# EAGLE schematic OneSchematicToRuleThemAll (EAGLE 9.5.1)
COMPANY: Inspire Clean Enery Pvt Ltd; DATE: 15/07/2020; DESIGNEDBY: Athar Zafeer
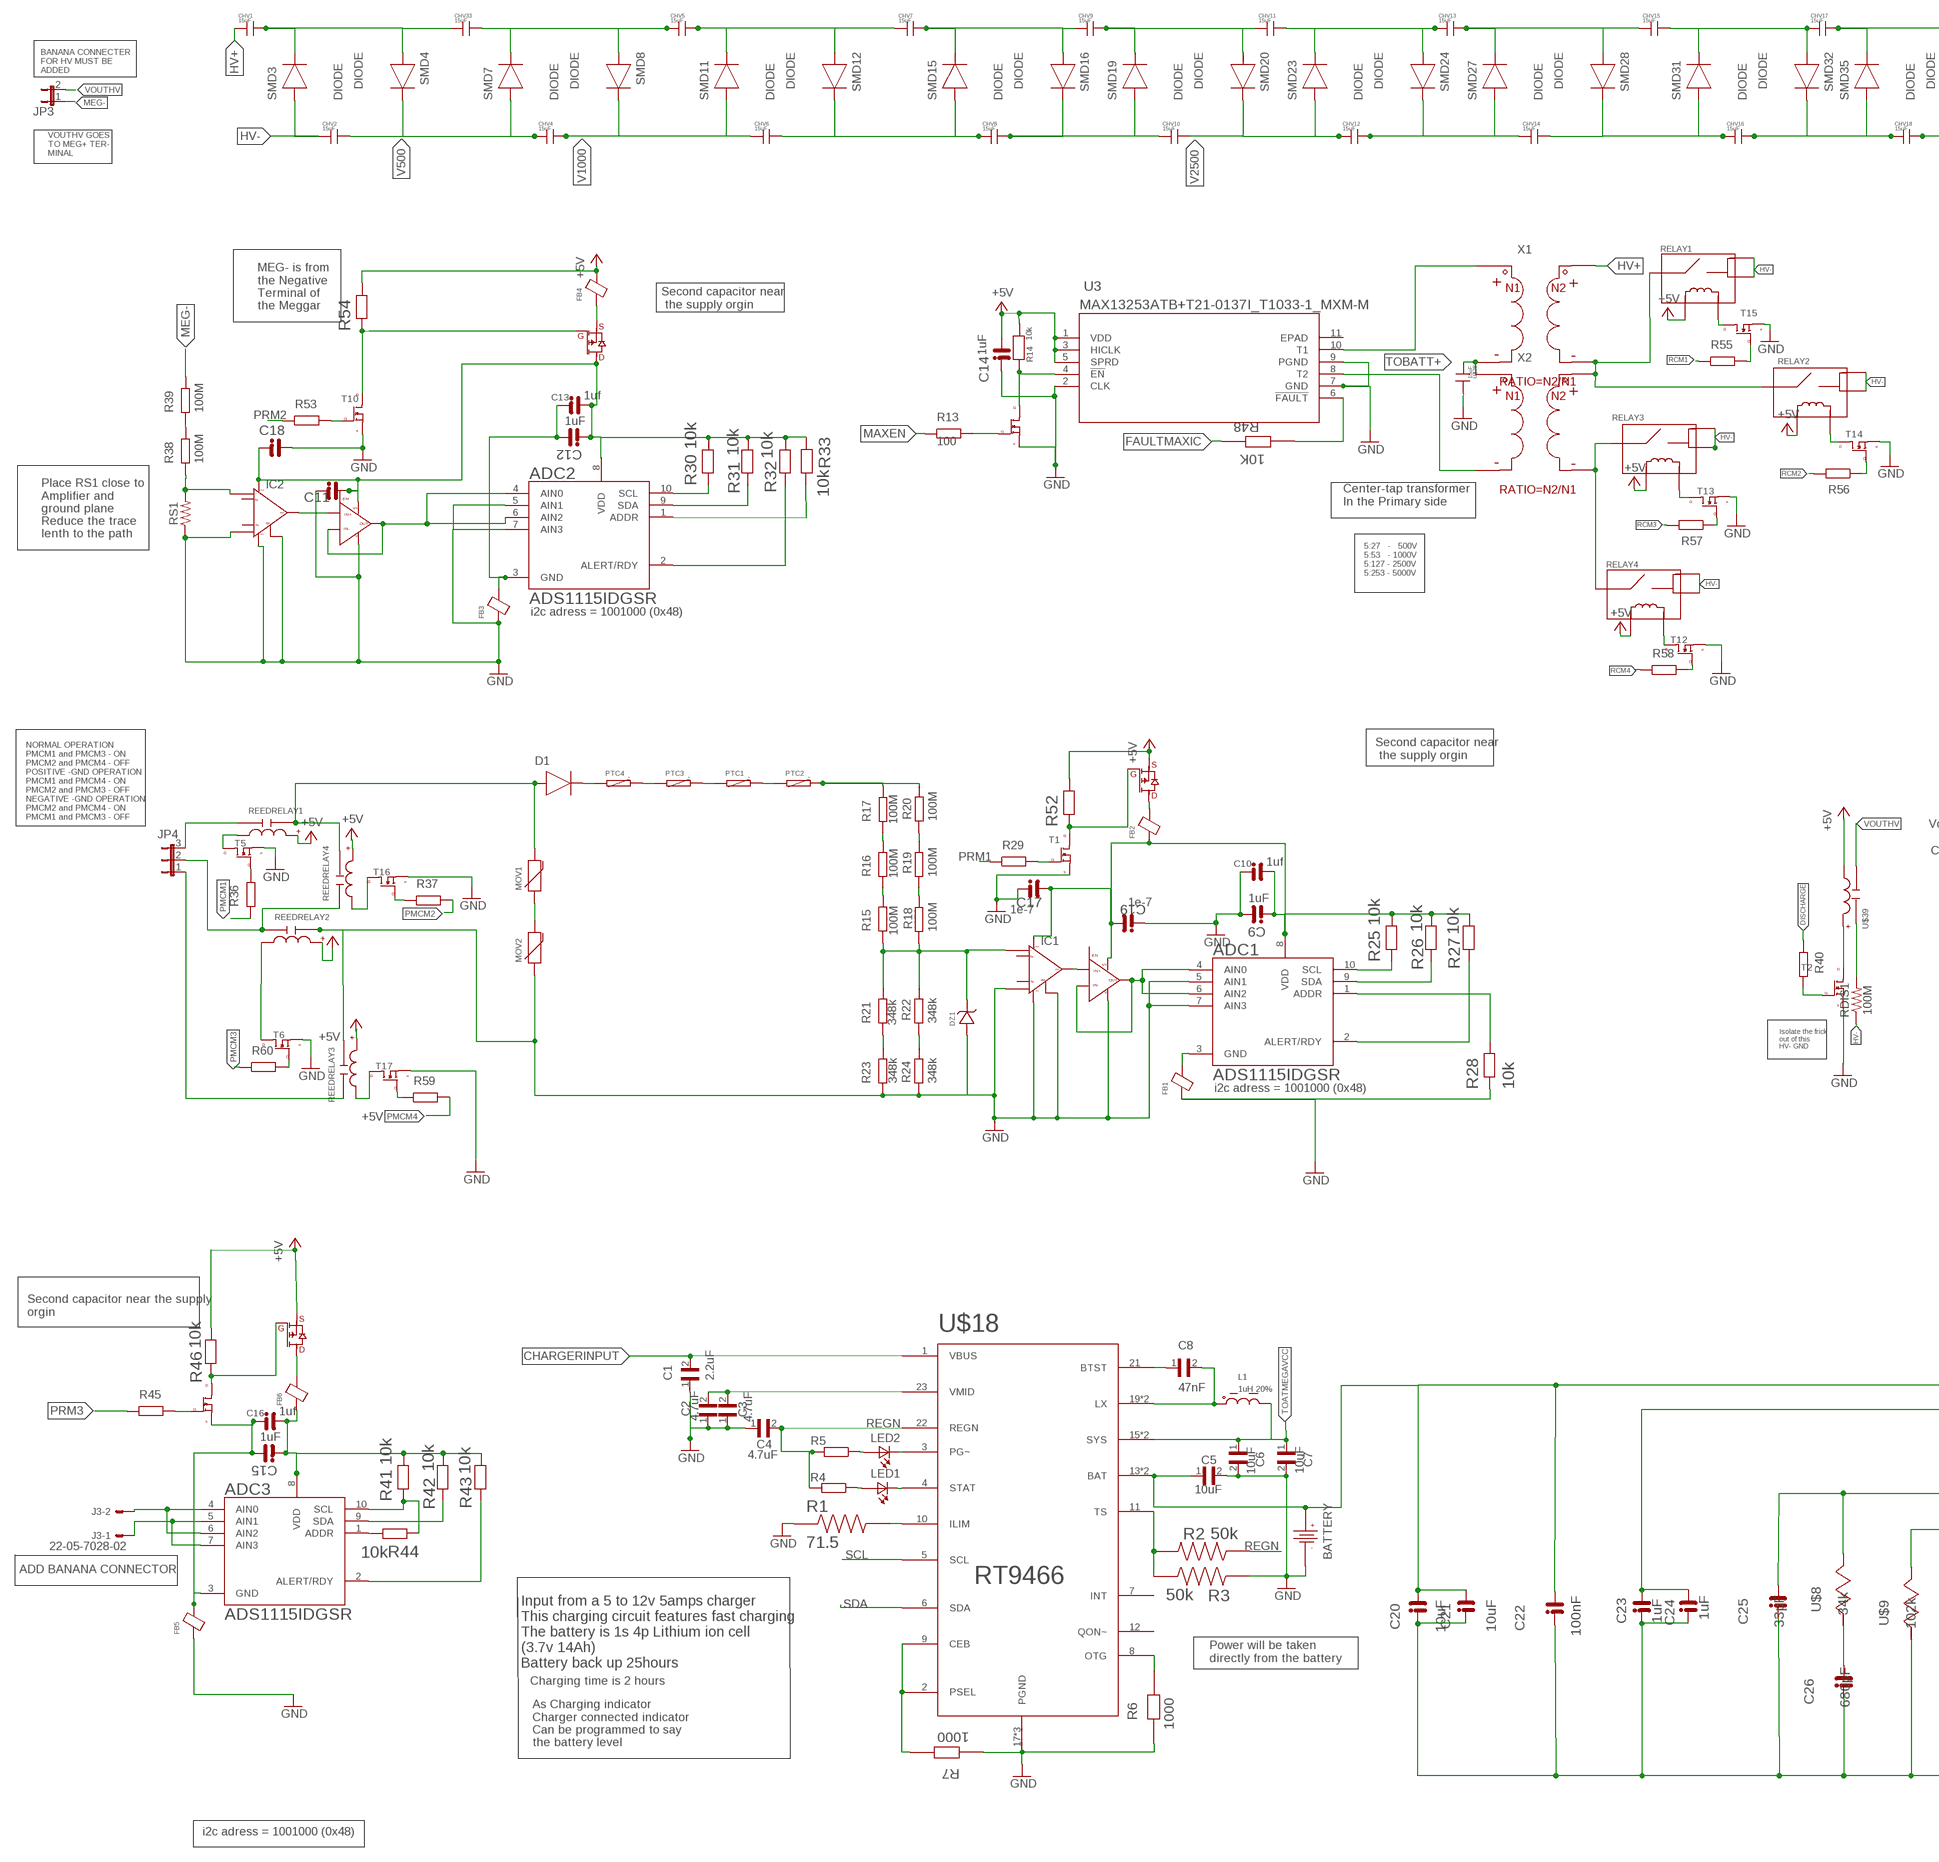
[diagram p0: schematic, sheet 1, part 1 of 2]
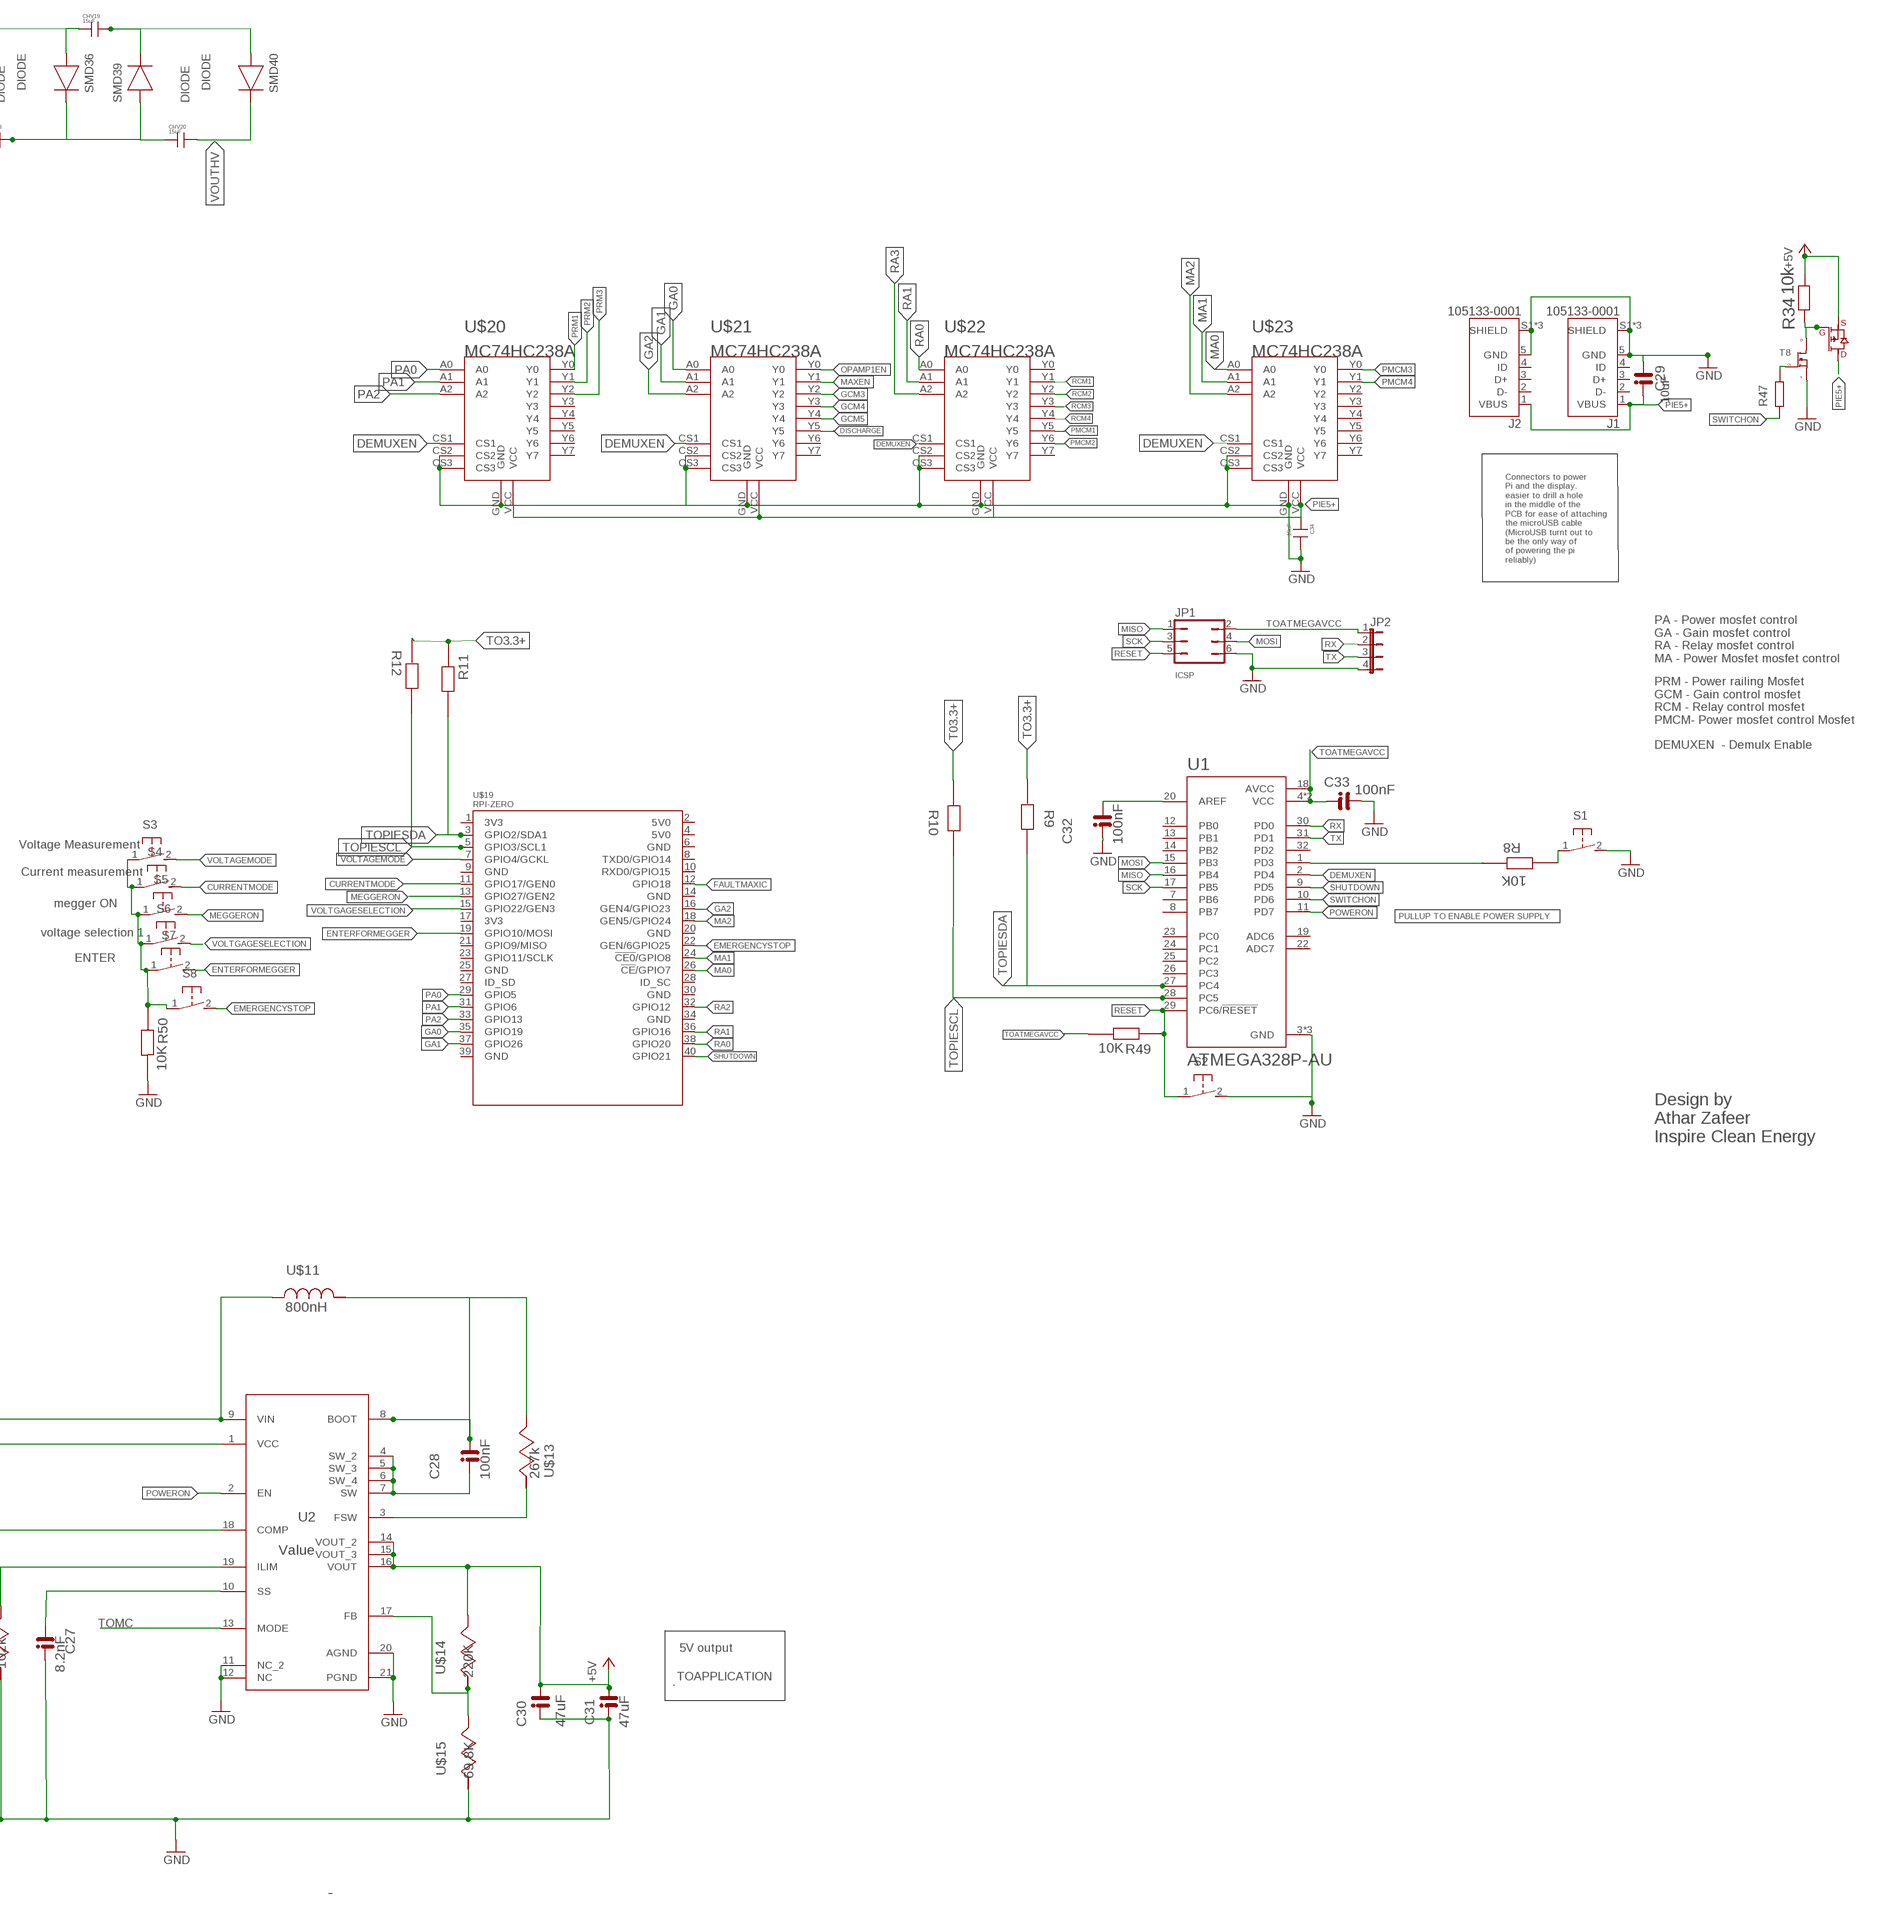
[diagram p1: schematic, sheet 1, part 2 of 2]

## Parts
ADC1  ADS1115IDGSR  [SOP50P490X110-10N]
ADC2  ADS1115IDGSR  [SOP50P490X110-10N]
ADC3  ADS1115IDGSR  [SOP50P490X110-10N]
BATT1  BATPADS  [PADSBATT]
C1  2.2uF  GRM155R61E225KE11D  [CAPC1005X70N]
C2  4.7uF  GRM188R61E475KE11D  [CAPC1608X95N]
C3  4.7uF  GRM188R61E475KE11D  [CAPC1608X95N]
C4  4.7uF  GRM188R61E475KE11D  [CAPC1608X95N]
C5  10uF  GRM185R60J106ME15J  [CAPC1608X50N]
C6  10uF  GRM185R60J106ME15J  [CAPC1608X50N]
C7  10uF  GRM185R60J106ME15J  [CAPC1608X50N]
C8  47nF  GRM033R61C473KE84D  [CAPC0603X33N]
C9  1uF  EMK107B7105KA-T  [0603]
C10  1uf  EMK107B7105KA-T  [0603]
C11  CC0402KRX5R7BB104  [0402]
C12  1uF  EMK107B7105KA-T  [0603]
C13  1uf  EMK107B7105KA-T  [0603]
C14  1uF  EMK107B7105KA-T  [0603]
C15  1uF  EMK107B7105KA-T  [0603]
C16  1uf  EMK107B7105KA-T  [0603]
C17  1e-7  CC0402KRX5R7BB104  [0402]
C18  CC0402KRX5R7BB104  [0402]
C19  1e-7  CC0402KRX5R7BB104  [0402]
C20  10uF  CC1206ZKY5V7BB106  [1206_190]
C21  10uF  CC1206ZKY5V7BB106  [1206_190]
C22  100nF  CC0402KRX5R7BB104  [0402]
C23  1uF  EMK107B7105KA-T  [0603]
C24  1uF  EMK107B7105KA-T  [0603]
C25  33pF  885012005043  [0402]
C26  680pF  CL10C681JA8NNNC  [0603]
C27  8.2nF  CC0402KRX7R7BB822  [0402]
C28  100nF  CC0402KRX5R7BB104  [0402]
C29  10uF  CC1206ZKY5V7BB106  [1206_190]
C30  47uF  C5750X5R1C476M230KA  [2220_250]
C31  47uF  C5750X5R1C476M230KA  [2220_250]
C32  100nF  CC0402KRX5R7BB104  [0402]
C33  100nF  CC0402KRX5R7BB104  [0402]
C34  15uF  CAPACTORFORTRANSFORMER  [C1210C156K8PACTU]
CHV1  15uF  CAPACITORSMDC5750SMD  [C5750]
CHV2  15uF  CAPACITORSMDC5750SMD  [C5750]
CHV4  15uF  CAPACITORSMDC5750SMD  [C5750]
CHV5  15uF  CAPACITORSMDC5750SMD  [C5750]
CHV6  15uF  CAPACITORSMDC5750SMD  [C5750]
CHV7  15uF  CAPACITORSMDC5750SMD  [C5750]
CHV8  15uF  CAPACITORSMDC5750SMD  [C5750]
CHV9  15uF  CAPACITORSMDC5750SMD  [C5750]
CHV10  15uF  CAPACITORSMDC5750SMD  [C5750]
CHV11  15uF  CAPACITORSMDC5750SMD  [C5750]
CHV12  15uF  CAPACITORSMDC5750SMD  [C5750]
CHV13  15uF  CAPACITORSMDC5750SMD  [C5750]
CHV14  15uF  CAPACITORSMDC5750SMD  [C5750]
CHV15  15uF  CAPACITORSMDC5750SMD  [C5750]
CHV16  15uF  CAPACITORSMDC5750SMD  [C5750]
CHV17  15uF  CAPACITORSMDC5750SMD  [C5750]
CHV18  15uF  CAPACITORSMDC5750SMD  [C5750]
CHV19  15uF  CAPACITORSMDC5750SMD  [C5750]
CHV20  15uF  CAPACITORSMDC5750SMD  [C5750]
CHV33  15uF  CAPACITORSMDC5750SMD  [C5750]
D1  GI1-1600GP-E3/54  [DO-15(DO-204AC)]
DZ1  PLZ4V3A-G3/H  [DO-219AC]
FB1  MMZ2012Y152BT000  [0805(2012METRIC)]
FB2  MMZ2012Y152BT000  [0805(2012METRIC)]
FB3  MMZ2012Y152BT000  [0805(2012METRIC)]
FB4  MMZ2012Y152BT000  [0805(2012METRIC)]
FB5  MMZ2012Y152BT000  [0805(2012METRIC)]
FB6  MMZ2012Y152BT000  [0805(2012METRIC)]
IC1  INA333  [8-VSSOP]
IC2  INA333  [8-VSSOP]
J1  105133-0001  [MOLEX_105133-0001]
J2  105133-0001  [MOLEX_105133-0001]
J3  22-05-7028-02  [7395-02]
JP1  JP3Q  [JP3Q]
JP2  JP4E  [JP4]
JP3  JP1E  [JP1]
JP4  JP2E  [JP2]
L1  1uH 20%  74438356010  [4020]
LED1  LTST-C191KGKT  [0603]
LED2  LTST-C191KGKT  [0603]
MOV1  V1000LA160BP  [CAPRR750W81L2100T1100H2300P]
MOV2  V1000LA160BP  [CAPRR750W81L2100T1100H2300P]
PTC1  PTCCL05H100SBE  [RADIAL,DISC]
PTC2  PTCCL05H100SBE  [RADIAL,DISC]
PTC3  PTCCL05H100SBE  [RADIAL,DISC]
PTC4  PTCCL05H100SBE  [RADIAL,DISC]
R1  71.5  RC0402FR-0771R5L  [RESC1005X40N]
R2  50k  ERA-3AEB4992V  [RESC1608X55N]
R3  50k  ERA-3AEB4992V  [RESC1608X55N]
R4  RX0402_100  [RC0402_100]
R5  RX0402_100  [RC0402_100]
R6  1000  ERJ-2GEJ102X  [RESC1005X40N]
R7  1000  ERJ-2GEJ102X  [RESC1005X40N]
R8  10K  ERJ-2GEJ102X  [RESC1005X40N]
R9  ERJ-2GEJ102X  [RESC1005X40N]
R10  ERJ-2GEJ102X  [RESC1005X40N]
R11  ERJ-2GEJ102X  [RESC1005X40N]
R12  ERJ-2GEJ102X  [RESC1005X40N]
R13  100  RX0402_100  [RC0402_100]
R14  10k  ERJ-3GEYJ103V  [RESC1608X55N]
R15  100M  HVA12FA100M  [AXIAL]
R16  100M  HVA12FA100M  [AXIAL]
R17  100M  HVA12FA100M  [AXIAL]
R18  100M  HVA12FA100M  [AXIAL]
R19  100M  HVA12FA100M  [AXIAL]
R20  100M  HVA12FA100M  [AXIAL]
R21  348k  HVR2500003483FR500  [AXIAL]
R22  348k  HVR2500003483FR500  [AXIAL]
R23  348k  HVR2500003483FR500  [AXIAL]
R24  348k  HVR2500003483FR500  [AXIAL]
R25  10k  ERJ-3GEYJ103V  [RESC1608X55N]
R26  10k  ERJ-3GEYJ103V  [RESC1608X55N]
R27  10k  ERJ-3GEYJ103V  [RESC1608X55N]
R28  10k  ERJ-3GEYJ103V  [RESC1608X55N]
R29  RX0402_100  [RC0402_100]
R30  10k  ERJ-3GEYJ103V  [RESC1608X55N]
R31  10k  ERJ-3GEYJ103V  [RESC1608X55N]
R32  10k  ERJ-3GEYJ103V  [RESC1608X55N]
R33  10k  ERJ-3GEYJ103V  [RESC1608X55N]
R34  10k  ERJ-3GEYJ103V  [RESC1608X55N]
R36  RX0402_100  [RC0402_100]
R37  RX0402_100  [RC0402_100]
R38  100M  HVA12FA100M  [AXIAL]
R39  100M  HVA12FA100M  [AXIAL]
R40  RX0402_100  [RC0402_100]
R41  10k  ERJ-3GEYJ103V  [RESC1608X55N]
R42  10k  ERJ-3GEYJ103V  [RESC1608X55N]
R43  10k  ERJ-3GEYJ103V  [RESC1608X55N]
R44  10k  ERJ-3GEYJ103V  [RESC1608X55N]
R45  RX0402_100  [RC0402_100]
R46  10k  ERJ-3GEYJ103V  [RESC1608X55N]
R47  RX0402_100  [RC0402_100]
R48  10K  ERJ-2GEJ102X  [RESC1005X40N]
R49  10K  ERJ-2GEJ102X  [RESC1005X40N]
R50  10K  ERJ-2GEJ102X  [RESC1005X40N]
R52  ERJ-3GEYJ103V  [RESC1608X55N]
R53  RX0402_100  [RC0402_100]
R54  ERJ-3GEYJ103V  [RESC1608X55N]
R55  RX0402_100  [RC0402_100]
R56  RX0402_100  [RC0402_100]
R57  RX0402_100  [RC0402_100]
R58  RX0402_100  [RC0402_100]
R59  RX0402_100  [RC0402_100]
R60  RX0402_100  [RC0402_100]
RDIS1  100M  RESISTOR20OHM  [RADIAL]
REEDRELAY1  REEDRELAYSPDT  [3351-1275-126]
REEDRELAY2  REEDRELAYSPDT  [3351-1275-126]
REEDRELAY3  REEDRELAYSPDT  [3351-1275-126]
REEDRELAY4  REEDRELAYSPDT  [3351-1275-126]
RELAY1  T9GS1L14-5  [T9GTERMINATIONCODE1]
RELAY2  T9GS1L14-5  [T9GTERMINATIONCODE1]
RELAY3  T9GS1L14-5  [T9GTERMINATIONCODE1]
RELAY4  T9GS1L14-5  [T9GTERMINATIONCODE1]
RS1  CURRENTSENSERESISTOR  [SL2TTED1002F]
S1  31-XX  [B3F-31XX]
S2  31-XX  [B3F-31XX]
S3  Voltage Measurement  31-XX  [B3F-31XX]
S4  Current measurement  31-XX  [B3F-31XX]
S5  megger ON  31-XX  [B3F-31XX]
S6  voltage selection 1  31-XX  [B3F-31XX]
S7  ENTER  31-XX  [B3F-31XX]
S8  EMERGENCY STOP  31-XX  [B3F-31XX]
SMD3  DIODE  [SMA]
SMD4  DIODE  [SMA]
SMD7  DIODE  [SMA]
SMD8  DIODE  [SMA]
SMD11  DIODE  [SMA]
SMD12  DIODE  [SMA]
SMD15  DIODE  [SMA]
SMD16  DIODE  [SMA]
SMD19  DIODE  [SMA]
SMD20  DIODE  [SMA]
SMD23  DIODE  [SMA]
SMD24  DIODE  [SMA]
SMD27  DIODE  [SMA]
SMD28  DIODE  [SMA]
SMD31  DIODE  [SMA]
SMD32  DIODE  [SMA]
SMD35  DIODE  [SMA]
SMD36  DIODE  [SMA]
SMD39  DIODE  [SMA]
SMD40  DIODE  [SMA]
T1  SI2302A  [SOT-23]
T2  SI2302A  [SOT-23]
T3  NX2301P,215  [SOT-23]
T5  SI2302A  [SOT-23]
T6  SI2302A  [SOT-23]
T7  NX2301P,215  [SOT-23]
T8  SI2302A  [SOT-23]
T9  NX2301P,215  [SOT-23]
T10  SI2302A  [SOT-23]
T11  NX2301P,215  [SOT-23]
T12  SI2302A  [SOT-23]
T13  SI2302A  [SOT-23]
T14  SI2302A  [SOT-23]
T15  SI2302A  [SOT-23]
T16  SI2302A  [SOT-23]
T17  SI2302A  [SOT-23]
U1  ATMEGA328P-AU  [QFP80P900X900X120-32N]
U2  Value  TPS61088RHLR  [RHL0020A]
U3  MAX13253ATB+T21-0137I_T1033-1_MXM-M  [21-0137I_T1033-1_MXM-M]
U$8  34k  CRCW040234K0FKED  [0402]
U$9  102k  CRCW0402102KFKED  [0402]
U$11  800nH  XAL5020-801MEB  [XAL5020]
U$13  267k  CRCW0402267KFKED  [0402]
U$14  220K  RC0603FR-07220KL  [0603]
U$15  69.8K  CRCW040269K8FKED  [0402]
U$18  RT9466  [V/W/U/XQFN4*4-24]
U$19  RPI-ZERO  [RASPBERRYPI_BASTELSTUBE_V13_RASPI_BOARD_B+_FULL]
U$20  MC74HC238A  [TSSOP−16]
U$21  MC74HC238A  [TSSOP−16]
U$22  MC74HC238A  [TSSOP−16]
U$23  MC74HC238A  [TSSOP−16]
U$25  OPA300-ND  [SOT23-6]
U$28  15uF  CAPACTORFORTRANSFORMER  [C1210C156K8PACTU]
U$29  OPA300-ND  [SOT23-6]
U$33  SI2302A  [SOT-23]
U$39  REEDRELAYSPDT  [3351-1275-126]
U$44  SI2302A  [SOT-23]
X1  TRANSFORMER  (no package)
X2  TRANSFORMER  (no package)

## Nets
+5V: C14.1 C30.1 C31.1 FB4.P$2 R14.2 R34.2 R46.2 R52.2 R54.2 REEDRELAY1.2 REEDRELAY2.2 REEDRELAY3.2 REEDRELAY4.2 RELAY1.C1 RELAY2.C1 RELAY3.C1 RELAY4.C1 T3.S T7.S T9.S U2.14(VOUT_2) U2.15(VOUT_3) U2.16(VOUT) U3.1(VDD) U3.3(HICLK) U3.5(SPRD) U$14.1 U$39.3
BATT+: BATT1.1 C5.1 C20.1 C21.1 C22.1 U2.9(VIN) U$11.1 U$18.13(BAT) U$18.14(BAT)
CHARGERINPUT: C1.2 U$18.1(VBUS)
CURRENTMODE: S4.2(S) U$19.11(GPIO17/GEN0)
DEMUXEN: U1.2(PD4) U$20.CS1 U$21.CS1 U$22.CS1 U$23.CS1
DISCHARGE: R40.P$1 U$21.Y5
EMERGENCYSTOP: S8.2(S) U$19.22(GEN/6GPIO25)
ENTERFORMEGGER: S7.2(S) U$19.19(GPIO10/MOSI)
FAULTMAXIC: R48.2 U$19.12(GPIO18)
GA0: U$19.35(GPIO19) U$21.A0
GA1: U$19.37(GPIO26) U$21.A1
GA2: U$19.16(GEN4/GPIO23) U$21.A2
GCM3: U$21.Y2
GCM4: U$21.Y3
GCM5: U$21.Y4
GND: ADC1.5(AIN1) ADC1.7(AIN3) ADC2.5(AIN1) ADC2.7(AIN3) BATT1.2 C1.1 C2.1 C3.1 C4.1 C5.2 C6.2 C7.2 C9.1 C10.2 C11.2 C14.2 C17.2 C18.1 C19.2 C20.2 C21.2 C22.2 C23.2 C24.2 C25.2 C26.2 C27.2 C29.1 C30.2 C31.2 C32.2 C33.1 C34.P$2 DZ1.P$1 FB1.P$1 FB3.P$1 FB5.P$1 IC1.-IN IC1.REF IC1.V-(-VS) IC2.-IN IC2.REF IC2.V-(-VS) J1.5(GND) J1.S1(SHIELD) J1.S2(SHIELD) J1.S3(SHIELD) J2.5(GND) J2.S1(SHIELD) J2.S2(SHIELD) J2.S3(SHIELD) JP1.6 JP2.4 MOV2.1 R1.1 R3.2 R6.1 R7.1 R23.P$1 R24.P$1 R28.1 R50.1 REEDRELAY2.1 REEDRELAY3.1 RS1.P$1 S1.2(S) S2.2(S) T1.S T2.S T5.S T6.S T8.S T10.S T12.S T13.S T14.S T15.S T16.S T17.S U1.3(GND) U1.5(GND) U1.21(GND) U2.11(NC_2) U2.12(NC) U2.20(AGND) U2.21(PGND) U3.2(CLK) U3.7(GND) U3.9(PGND) U$9.2 U$15.2 U$18.17(PGND) U$18.18(PGND) U$18.25(PGND) U$20.CS2 U$20.CS3 U$20.GND U$21.CS2 U$21.CS3 U$21.GND U$22.CS2 U$22.CS3 U$22.GND U$23.CS2 U$23.CS3 U$23.GND U$25.P$2(V-) U$28.P$2 U$29.P$2(V-) U$33.S
HV+: CHV1.P$1 X1.P$3
HV-: CHV2.P$1 RDIS1.P$1 RELAY1.NO RELAY1.P$1 RELAY2.NO RELAY2.P$1 RELAY3.COM RELAY3.NO RELAY3.P$1 RELAY4.COM RELAY4.NO RELAY4.P$1 SMD3.P$1(A) X2.P$4
MA0: U$19.26(!CE!/GPIO7) U$23.A0
MA1: U$19.24(!CE0!/GPIO8) U$23.A1
MA2: U$19.18(GEN5/GPIO24) U$23.A2
MAXEN: R13.P$1 U$21.Y1
MEG-: JP3.1 R39.P$2
MEGGERON: S5.2(S) U$19.13(GPIO27/GEN2)
MISO: JP1.1 U1.16(PB4)
MOSI: JP1.4 U1.15(PB3)
N$2: C32.1 U1.20(AREF)
N$5: C23.1 C24.1 U2.1(VCC)
N$6: C26.1 U$8.2
N$7: R8.1 S1.1(P)
N$8: C2.2 C3.2 U$18.23(VMID)
N$9: C25.1 U2.18(COMP) U$8.1
N$10: U2.19(ILIM) U$9.1
N$11: C27.1 U2.10(SS)
N$12: LED1.2(A2) R4.P$1
N$13: C8.1 U$18.21(BTST)
N$14: U2.3(FSW) U$13.2
N$15: C28.2 U2.4(SW_2) U2.5(SW_3) U2.6(SW_4) U2.7(SW)
N$16: R53.P$2
N$17: C8.2 L1.P$1 U$18.19(LX) U$18.20(LX)
N$18: U2.17(FB) U$14.2 U$15.1
N$19: LED1.1(K2) U$18.4(STAT)
N$20: LED2.1(K2) U$18.3(PG~)
N$21: R1.2 U$18.10(ILIM)
N$22: R2.2 R3.1 U$18.11(TS)
N$23: LED2.2(A2) R5.P$1
N$24: R6.2 U$18.8(OTG)
N$25: R7.2 U$18.2(PSEL) U$18.9(CEB)
N$26: R34.1 T3.G T8.D
N$27: R48.1 U3.6(!FAULT)
N$28: R8.2 U1.1(PD3)
N$29: R47.P$2 T8.G
N$30: CHV1.P$2 CHV33.P$1 SMD3.P$2(C) SMD4.P$1(A)
N$31: CHV5.P$1 CHV33.P$2 SMD7.P$2(C) SMD8.P$1(A)
N$32: CHV5.P$2 CHV7.P$1 SMD11.P$2(C) SMD12.P$1(A)
N$33: CHV6.P$2 CHV8.P$1 SMD12.P$2(C) SMD15.P$1(A)
N$34: CHV7.P$2 CHV9.P$1 SMD15.P$2(C) SMD16.P$1(A)
N$35: CHV8.P$2 CHV10.P$1 SMD16.P$2(C) SMD19.P$1(A)
N$36: CHV9.P$2 CHV11.P$1 SMD19.P$2(C) SMD20.P$1(A)
N$37: CHV11.P$2 CHV13.P$1 SMD23.P$2(C) SMD24.P$1(A)
N$38: CHV12.P$2 CHV14.P$1 SMD24.P$2(C) SMD27.P$1(A)
N$39: CHV13.P$2 CHV15.P$1 SMD27.P$2(C) SMD28.P$1(A)
N$40: CHV15.P$2 CHV17.P$1 SMD31.P$2(C) SMD32.P$1(A)
N$41: CHV14.P$2 CHV16.P$1 SMD28.P$2(C) SMD31.P$1(A)
N$42: CHV16.P$2 CHV18.P$1 SMD32.P$2(C) SMD35.P$1(A)
N$43: CHV17.P$2 CHV19.P$1 SMD35.P$2(C) SMD36.P$1(A)
N$44: CHV19.P$2 SMD39.P$2(C) SMD40.P$1(A)
N$45: CHV18.P$2 CHV20.P$1 SMD36.P$2(C) SMD39.P$1(A)
N$46: R14.1 U3.4(!EN) U$33.D
N$47: U3.8(T2) X2.P$2
N$48: U3.10(T1) X1.P$1
N$49: RELAY1.COM RELAY2.COM X1.P$4 X2.P$3
N$50: IC2.+IN R38.P$1 RS1.P$2
N$52: R13.P$2 U$33.G
N$53: T2.D U$39.2
N$54: R40.P$2 T2.G
N$55: JP4.3 REEDRELAY1.4
N$56: JP4.2 REEDRELAY2.4 REEDRELAY4.4
N$57: PTC2.P$2 R17.P$2 R20.P$2
N$58: R15.P$2 R16.P$1
N$59: DZ1.P$2 IC1.+IN R15.P$1 R18.P$1 R21.P$2 R22.P$2
N$60: R21.P$1 R23.P$2
N$61: R16.P$2 R17.P$1
N$62: R18.P$2 R19.P$1
N$63: R22.P$1 R24.P$2
N$64: FB4.P$1 T11.S
N$65: R19.P$2 R20.P$1
N$66: ADC1.10(SCL) R25.1
N$67: D1.P$2(C) PTC4.P$1
N$68: PTC3.P$1 PTC4.P$2
N$69: PTC1.P$1 PTC3.P$2
N$70: PTC1.P$2 PTC2.P$1
N$71: MOV1.1 MOV2.2
N$72: ADC1.9(SDA) R26.1
N$73: ADC1.1(ADDR) R28.2
N$74: ADC1.2(ALERT/RDY) R27.1
N$75: IC1.VOUT(OUT) U$25.P$3(IN+)
N$76: R52.1 T1.D T9.G
N$78: C28.1 U2.8(BOOT) U$11.2 U$13.1
N$79: R29.P$2
N$80: JP4.1 REEDRELAY3.4
N$81: ADC2.10(SCL) R30.1
N$82: ADC2.9(SDA) R31.1
N$83: ADC2.1(ADDR) R33.2
N$84: ADC2.2(ALERT/RDY) R32.1
N$85: ADC2.3(GND) C12.1 C13.2 FB3.P$2
N$86: ADC2.8(VDD) R30.2 R31.2 R32.2 R33.1
N$89: REEDRELAY1.3 T5.D
N$90: R38.P$2 R39.P$1
N$91: REEDRELAY4.3 T16.D
N$92: R37.P$1 T16.G
N$93: RDIS1.P$2 U$39.1
N$94: ADC3.1(ADDR) R44.2
N$95: ADC3.10(SCL) R41.1 R44.1
N$96: ADC3.9(SDA) R42.1
N$97: ADC3.4(AIN0) ADC3.6(AIN2) J3.2
N$98: ADC3.2(ALERT/RDY) R43.1
N$99: ADC3.3(GND) C15.1 C16.2 FB5.P$2 U$44.S
N$100: ADC3.8(VDD) C15.2 C16.1 FB6.P$1 R41.2 R42.2 R43.2
N$101: ADC3.5(AIN1) ADC3.7(AIN3) J3.1
N$102: R45.P$2 U$44.G
N$103: FB2.P$2 T9.D
N$104: IC2.VOUT(OUT) U$29.P$3(IN+)
N$111: R50.2 S3.1(P) S4.1(P) S5.1(P) S6.1(P) S7.1(P) S8.1(P)
N$114: FB6.P$2 T7.D
N$115: R54.1 T10.D T11.G
N$116: R46.1 T7.G U$44.D
N$117: ADC1.8(VDD) C9.2 C10.1 C17.1 C19.1 FB2.P$1 IC1.V+(+VS) R25.2 R26.2 R27.2 U$25.P$6(V+)
N$118: ADC1.4(AIN0) ADC1.6(AIN2) U$25.P$1(OUT) U$25.P$4(IN-)
N$119: ADC2.4(AIN0) ADC2.6(AIN2) U$29.P$1(OUT) U$29.P$4(IN-)
N$120: C11.1 C12.2 C13.1 C18.2 IC2.V+(+VS) T11.D U$29.P$6(V+)
N$121: ADC1.3(GND) FB1.P$2
N$122: R36.P$2 T5.G
N$125: RELAY2.C2 T14.D
N$126: RELAY3.C2 T13.D
N$127: RELAY4.C2 T12.D
N$128: RELAY1.C2 T15.D
N$129: R55.P$2 T15.G
N$130: R56.P$1 T14.G
N$131: R57.P$1 T13.G
N$132: R58.P$2 T12.G
N$133: R60.P$2 T6.G
N$134: REEDRELAY2.3 T6.D
N$136: REEDRELAY3.3 T17.D
N$137: R59.P$1 T17.G
OPAMP1EN: U$21.Y0
PA0: U$19.29(GPIO5) U$20.A0
PA1: U$19.31(GPIO6) U$20.A1
PA2: U$19.33(GPIO13) U$20.A2
PIE5+: C29.2 C34.P$1 J1.1(VBUS) J2.1(VBUS) T3.D U$20.VCC U$21.VCC U$22.VCC U$23.VCC
PMCM1: R36.P$1 U$22.Y5
PMCM2: R37.P$2 U$22.Y6
PMCM3: R60.P$1 U$23.Y0
PMCM4: R59.P$2 U$23.Y1
POWERON: U1.11(PD7) U2.2(EN)
PRM1: R29.P$1 U$20.Y0
PRM2: R53.P$1 U$20.Y1
PRM3: R45.P$1 U$20.Y2
RA0: U$19.38(GPIO20) U$22.A0
RA1: U$19.36(GPIO16) U$22.A1
RA2: U$19.32(GPIO12)
RA3: U$22.A2
RCM1: R55.P$1 U$22.Y1
RCM2: R56.P$2 U$22.Y2
RCM3: R57.P$2 U$22.Y3
RCM4: R58.P$1 U$22.Y4
REGN: C4.2 R2.1 R4.P$2 R5.P$2 U$18.22(REGN)
RESET: JP1.5 R49.2 S2.1(P) U1.29(PC6/!RESET)
RX: JP2.2 U1.30(PD0)
SCK: JP1.3 U1.17(PB5)
SCL: U$18.5(SCL)
SDA: U$18.6(SDA)
SHUTDOWN: U1.9(PD5) U$19.40(GPIO21)
SWITCHON: R47.P$1 U1.10(PD6)
T03.3+: R10.1
TO3.3+: R9.1 R11.2 R12.1
TO+BANANA: D1.P$1(A) MOV1.2 REEDRELAY1.1 REEDRELAY4.1
TOATMEGAVCC: C6.1 C7.1 C33.2 JP1.2 JP2.1 L1.P$2 R49.1 U1.4(VCC) U1.6(VCC) U1.18(AVCC) U$18.15(SYS) U$18.16(SYS)
TOBATT+: U$28.P$1 X1.P$2 X2.P$1
TOMC: U2.13(MODE)
TOPIESCL: R10.2 R12.2 U1.28(PC5) U$19.5(GPIO3/SCL1)
TOPIESDA: R9.2 R11.1 U1.27(PC4) U$19.3(GPIO2/SDA1)
TX: JP2.3 U1.31(PD1)
V500: CHV2.P$2 CHV4.P$1 SMD4.P$2(C) SMD7.P$1(A)
V1000: CHV4.P$2 CHV6.P$1 SMD8.P$2(C) SMD11.P$1(A)
V2500: CHV10.P$2 CHV12.P$1 SMD20.P$2(C) SMD23.P$1(A)
VOLTAGEMODE: S3.2(S) U$19.7(GPIO4/GCKL)
VOLTGAGESELECTION: S6.2(S) U$19.15(GPIO22/GEN3)
VOUTHV: CHV20.P$2 JP3.2 SMD40.P$2(C) U$39.4
Unconnected: IC1.+RG IC1.-RG(RG-) IC2.+RG IC2.-RG(RG-) J1.2(D-) J1.3(D+) J1.4(ID) J2.2(D-) J2.3(D+) J2.4(ID) T1.G T10.G U1.7(PB6) U1.8(PB7) U1.12(PB0) U1.13(PB1) U1.14(PB2) U1.19(ADC6) U1.22(ADC7) U1.23(PC0) U1.24(PC1) U1.25(PC2) U1.26(PC3) U1.32(PD2) U3.11(EPAD) U$18.7(INT) U$18.12(QON~) U$19.1(3V3) U$19.2(5V0) U$19.4(5V0) U$19.6(GND) U$19.8(TXD0/GPIO14) U$19.9(GND) U$19.10(RXD0/GPIO15) U$19.14(GND) U$19.17(3V3) U$19.20(GND) U$19.21(GPIO9/MISO) U$19.23(GPIO11/SCLK) U$19.25(GND) U$19.27(ID_SD) U$19.28(ID_SC) U$19.30(GND) U$19.34(GND) U$19.39(GND) U$20.Y3 U$20.Y4 U$20.Y5 U$20.Y6 U$20.Y7 U$21.Y6 U$21.Y7 U$22.Y0 U$22.Y7 U$23.Y2 U$23.Y3 U$23.Y4 U$23.Y5 U$23.Y6 U$23.Y7 U$25.P$5(EN) U$29.P$5(EN)

## Notes on the sheet
- BANANA CONNECTER 
  FOR HV MUST BE 
  ADDED
- VOUTHV GOES
  TO MEG+ TER-
  MINAL
- Second capacitor near
   the supply orgin
- MEG- is from
  the Negative
  Terminal of
  the Meggar
- Center-tap transformer
  In the Primary side
- Place RS1 close to
  Amplifier and 
  ground plane
  Reduce the trace 
  lenth to the path
- Connectors to power
  Pi and the display.
  easier to drill a hole 
  in the middle of the
  PCB for ease of attaching
  the microUSB cable
  (MicroUSB turnt out to
  be the only way of 
  of powering the pi
  reliably)
- 5:27   -   500V
  5:53   - 1000V
  5:127 - 2500V
  5:253 - 5000V
- i2c adress = 1001000 (0x48)
- PA - Power mosfet control  
  GA - Gain mosfet control
  RA - Relay mosfet control
  MA - Power Mosfet mosfet control
- ICSP
- PRM - Power railing Mosfet
  GCM - Gain control mosfet
  RCM - Relay control mosfet
  PMCM- Power mosfet control Mosfet
- DEMUXEN  - Demulx Enable
- Second capacitor near
   the supply orgin
- NORMAL OPERATION
  PMCM1 and PMCM3 - ON
  PMCM2 and PMCM4 - OFF
  POSITIVE -GND OPERATION
  PMCM1 and PMCM4 - ON
  PMCM2 and PMCM3 - OFF
  NEGATIVE -GND OPERATION
  PMCM2 and PMCM4 - ON
  PMCM1 and PMCM3 - OFF
- PULLUP TO ENABLE POWER SUPPLY
- Isolate the frick 
  out of this
  HV- GND
- i2c adress = 1001000 (0x48)
- Design by
  Athar Zafeer
  Inspire Clean Energy
- Second capacitor near the supply
  orgin
- BATTERY
- ADD BANANA CONNECTOR
- 5V output
- TOAPPLICATION
- Power will be taken
  directly from the battery
- Input from a 5 to 12v 5amps charger
  This charging circuit features fast charging
  The battery is 1s 4p Lithium ion cell
  (3.7v 14Ah)
  Battery back up 25hours
- Charging time is 2 hours
- As Charging indicator
  Charger connected indicator
  Can be programmed to say
  the battery level
- i2c adress = 1001000 (0x48)

## Library data of the parts
ADC1-ADC3 = Ampparts:ADS1115IDGSR: 16-Bit ADC with Integrated MUX, PGA, Comparator, Oscillator, and Reference 10-VSSOP -40 to 125; DESCRIPTION: 16 Bit Analog to Digital Converter 2, 4 Input 1 Sigma-Delta 10-VSSOP; DIGI-KEY_PART_NUMBER: 296-38849-1-ND; MF: Texas Instruments; MP: ADS1115IDGSR; PACKAGE: MSOP-10 Texas Instruments; TEXAS_INSTRUMENTS-PURCHASE-URL: https://snapeda.com/shop?store=Texas+Instruments&id=45903
BATT1 = BatteryCharger:BATPADS: JUST 10 x 10 mm exposed pads for battery
C1 = BatteryCharger:GRM155R61E225KE11D; DESCRIPTION: SMD Capacitor X5R(EIA) with Capacitance: 2.2uF Tol. 10%. Rated Voltage: 25Vdc; DIGI-KEY_PART_NUMBER: 490-12703-1-ND; MF: Murata; MP: GRM155R61E225KE11D; PACKAGE: 1005 Murata
C2-C4 = BatteryCharger:GRM188R61E475KE11D: Cap Ceramic 4.7uF 25V X5R 10% Pad SMD 0603 85°C T/R; DESCRIPTION: SMD Capacitor X5R(EIA) with Capacitance: 4.7uF Tol. 10%. Rated Voltage: 25Vdc; DIGI-KEY_PART_NUMBER: 490-7203-1-ND; DIGIKEY-PURCHASE-URL: https://snapeda.com/shop?store=DigiKey&id=4377500; MF: Murata; MOUSER-PURCHASE-URL: https://snapeda.com/shop?store=Mouser&id=4377500; MP: GRM188R61E475KE11D; PACKAGE: 1608 Murata
C5-C7 = BatteryCharger:GRM185R60J106ME15J; DESCRIPTION: SMD Capacitor X5R(EIA) with Capacitance: 10uF Tol. 20%. Rated Voltage: 6.3Vdc; DIGI-KEY_PART_NUMBER: 490-16349-1-ND; DIGIKEY-PURCHASE-URL: https://snapeda.com/shop?store=DigiKey&id=4386484; MF: Murata; MOUSER-PURCHASE-URL: https://snapeda.com/shop?store=Mouser&id=4386484; MP: GRM185R60J106ME15J; PACKAGE: 1608 Murata
C8 = BatteryCharger:GRM033R61C473KE84D: Cap Ceramic 0.047uF 16V X5R 10% SMD 0201 85°C Paper T/R; DESCRIPTION: SMD Capacitor X5R(EIA) with Capacitance: 47000pF Tol. 10%. Rated Voltage: 16Vdc; DIGI-KEY_PART_NUMBER: 490-7227-1-ND; MF: Murata; MP: GRM033R61C473KE84D; PACKAGE: 0603 Taiyo Yuden
C9 C10 C12-C16 C24 = powersupply:EMK107B7105KA-T; CAP: 1.0E6; DATASHEETURL: httpwww.yuden.co.jputproductpdfdjmk%5Fe.pdf; ESR: 0.001; IRMS: 0.0; MANUFACTURER_NAME: Taiyo Yuden; MANUFACTURER_PART_NUMBER: EMK107B7105KAT; VDC: 16.0; VENDOR: Taiyo Yuden
C11 C17-C19 C22 C28 C32 C33 = powersupply:CC0402KRX5R7BB104: 0.1µF ±10% 16V Ceramic Capacitor X5R 0402 (1005 Metric); CAP: 1.0E7; ESR: 0.0; IRMS: 0.0; MANUFACTURER_NAME: yageo; MANUFACTURER_PART_NUMBER: /CC0402KRX5R7BB104; VDC: 16.0; VENDOR: Digikey
C20 C21 C29 = powersupply:CC1206ZKY5V7BB106; CAP: 1.0E5; ESR: 0.0; IRMS: 0.0; MANUFACTURER_NAME: Yageo; MANUFACTURER_PART_NUMBER: CC1206ZKY5V7BB106; VDC: 16.0; VENDOR: Digikey
C23 = powersupply:EMK107B7105KA-T; CAP: 1.0E6; DATASHEETURL: httpwww.yuden.co.jputproductpdfdjmk%5Fe.pdf; ESR: 0.001; IRMS: 0.0; MANUFACTURER_NAME: Taiyo Yuden; MANUFACTURER_PART_NUMBER: EMK107B7105KAT; SPICEPREFIX: B; VDC: 16.0; VENDOR: Taiyo Yuden
C25 = powersupply:885012005043; CAP: 3.3E11; ESR: 0.0; IRMS: 0.0; MANUFACTURER_NAME: Würth Elektronik; MANUFACTURER_PART_NUMBER: 885012005043; VDC: 25.0; VENDOR: MuRata
C26 = powersupply:CL10C681JA8NNNC; CAP: 6.8E10; DATASHEETURL: httpwww.samsungsem.comservletFileDownload?type%3Dspec%26file%3DCL10C681JA8NNNC.pdf; ESR: 0.0; IRMS: 0.0; MANUFACTURER_NAME: Samsung ElectroMechanics; MANUFACTURER_PART_NUMBER: CL10C681JA8NNNC; VDC: 25.0; VENDOR: Samsung ElectroMechanics
C27 = powersupply:CC0402KRX7R7BB822; CAP: 8.2E9; ESR: 0.0; IRMS: 0.0; MANUFACTURER_NAME: Yageo; MANUFACTURER_PART_NUMBER: CC0402KRX7R7BB822; VDC: 16.0; VENDOR: MuRata
C30 C31 = powersupply:C5750X5R1C476M230KA; CAP: 4.7E5; DATASHEETURL: httpsproduct.tdk.comensearchcapacitorceramicmlccinfo?part%5Fno%3DC5750X5R1C476M230KA; ESR: 0.003162; IRMS: 5.13436; MANUFACTURER_NAME: TDK; MANUFACTURER_PART_NUMBER: C5750X5R1C476M230KA; VDC: 16.0; VENDOR: TDK
C34 U$28 = CAP_Diode_Megger:CAPACTORFORTRANSFORMER: KEMET’s X5R dielectric features an 85°C maximum operating temperature and is considered “semi-stable.” The Electronics Components, Assemblies & Materials Association (EIA) characterizes X5R dielectric as a Class II material. Components of this classification are fixed, ceramic dielectric capacitors suited for bypass and decoupling applications or for frequency discriminating circuits where Q and stability of capacitance characteristics are not critical. X5R exhibits a predictable change in capacitance with respect to time and voltage and boasts a minimal change in capacitance with reference to ambient temperature. Capacitance change is limited to ±15% from −55°C to +85°C Modelled by Athar Zafeer; CAPACITANCE: 15µF; MANUFACTURER: KEMET; PACKAGE: 1210; PARTNO: C1210C156K8PACTU; TOLERANCE: ±10%
CHV1 = CAP_Diode_Megger:CAPACITORSMDC5750: Middle voltage C series, commercial grade of TDK's multilayer ceramic chip capacitor, is a product which has the high withstanding voltage characteristics. The lineup is voltage rating of 100V to 630V with capacitance range up to 22µF. Product link (digikey) 2.2µF ±10% 450V Ceramic Capacitor X6S 2220 (5750 Metric) Datasheet Model by Athar Zafeer
CHV2 CHV4-CHV20 CHV33 = CAP_Diode_Megger:CAPACITORSMDC5750: Middle voltage C series, commercial grade of TDK's multilayer ceramic chip capacitor, is a product which has the high withstanding voltage characteristics. The lineup is voltage rating of 100V to 630V with capacitance range up to 22µF. Product link (digikey) 2.2µF ±10% 450V Ceramic Capacitor X6S 2220 (5750 Metric) Datasheet Model by Athar Zafeer; SPICEPREFIX: C
D1 = VoltagemeasurementComponents:GI1-1600GP-E3/54: DIODE GEN PURP 1.6KV 1A DO204AC; MANUFACTURER: Vishay Semiconductor Diodes Division; PACKAGE: DO-204AC, DO-15, Axial; VR: 1600V
DZ1 = VoltagemeasurementComponents:PLZ4V3A-G3/H: DIODE ZENER 4.165V 960MW DO219AC; MANUFACTURER: Vishay Semiconductor Diodes Division; PACKAGE: DO-219AC; VZ: 4.17V
FB1-FB6 = Ampparts:MMZ2012Y152BT000: 1.5 kOhms @ 100MHz 1 Signal Line Ferrite Bead 0805 (2012 Metric) 500mA 400mOhm; MANUFACTURER: TDK Corporation; PACKAGE: 0805 (2012 Metric)
IC1 IC2 = Ampparts:INA333: Instrumentation Amplifier 1 Circuit Rail-to-Rail 8-VSSOP; MANUFACTURER: Texas Instruments; PACKAGE: 8-VSSOP; PARTNO: INA333AIDGKRG4
J1 J2 = 105133-0001:105133-0001: Conn Micro USB Type B RCP 5 POS 0.65mm Solder RA SMD 5 Terminal 1 Port Embossed T/R; DESCRIPTION: USB - micro B USB 2.0 Receptacle Connector 5 Position Surface Mount; DIGI-KEY_PART_NUMBER: WM9734CT-ND; DIGIKEY-PURCHASE-URL: https://snapeda.com/shop?store=DigiKey&id=423273; MF: Molex; MP: 1051330001; PACKAGE: None
J3 = con-molex:22-?-02: CONNECTOR wire to board 2.54 mm (.1 inch) pitch header; MF: MOLEX; OC_FARNELL: 9731601; OC_NEWARK: unknown
JP1 = jumper:JP3Q: JUMPER
JP2 = jumper:JP4E: JUMPER
JP3 = jumper:JP1E: JUMPER
JP4 = jumper:JP2E: JUMPER
L1 = BatteryCharger:74438356010: 1µH Shielded Molded Inductor 7.2A 15mOhm Max 2-SMD Datasheet; MANUFACTURER: Würth Elektronik; PACKAGE: 4020; PARTNO: 74438356010
LED1 LED2 = BatteryCharger:LTST-C191KGKT: http://octopart.com/ltst-c190krkt-lite-on-549893; DESCRIPTION: Green 571nm LED Indication - Discrete 2V 0603 (1608 Metric); DIGI-KEY_PART_NUMBER: 160-1446-1-ND; MF: Lite-On Inc.; MP: LTST-C191KGKT; PACKAGE: 0603 Lite-On Inc.
MOV1 MOV2 = VoltagemeasurementComponents:V1000LA160BP; MANUFACTURER: Littelfuse Inc.; PACKAGE: Disc 20mm; VARISTORVOLY: 1.425kV; VDC: 1.2kv; VRMS: 1kV
PTC1-PTC4 = VoltagemeasurementComponents:PTCCL05H100SBE; CURRENTTRIP: 20mA; MANUFACTURER: Vishay BC Components; TYPE: Ceramic; VOLTAGE: 600V
R1 = BatteryCharger:RC0402FR-0771R5L: Res Thick Film 0402 71.5 Ohm 1% 1/16W ±100ppm/°C Molded SMD Paper T/R; ARROW_AMERICAS-PURCHASE-URL: https://snapeda.com/shop?store=Arrow+Americas&id=938739; DESCRIPTION: RC Series 0402 0.063 W 71.5 Ohms ±1% ±100 ppm/°C SMT Thick Film Chip Resistor; DIGI-KEY_PART_NUMBER: YAG3223CT-ND; MF: Yageo; MOUSER-PURCHASE-URL: https://snapeda.com/shop?store=Mouser&id=938739; MP: RC0402FR-0771R5L; PACKAGE: 1005 Panasonic Electronic Components
R2 R3 = BatteryCharger:ERA-3AEB4992V: Res Thin Film 0603 49.9K Ohm 0.1% 1/10W ±25ppm/°C Molded SMD SMD Punched Carrier T/R; DESCRIPTION: 49.9 kOhms ±0.1% 0.1W, 1/10W Chip Resistor 0603 (1608 Metric) Automotive AEC-Q200 Thin Film; DIGI-KEY_PART_NUMBER: P49.9KDBCT-ND; DIGIKEY-PURCHASE-URL: https://snapeda.com/shop?store=DigiKey&id=388585; MF: Panasonic; MOUSER-PURCHASE-URL: https://snapeda.com/shop?store=Mouser&id=388585; MP: ERA-3AEB4992V; PACKAGE: 1608 Panasonic Electronic Components
R4 R5 R13 R29 R36 R37 R40 R45 R47 R53 R55-R60 = Ampparts:RX0402_100: 100 Ohms ±1% 0.063W, 1/16W Chip Resistor 0402 (1005 Metric) Moisture Resistant Thick Film; MANUFACTURER: Yageo; PARTNO: RC0402FR-07100RL; POWER: 0.063W, 1/16W; RESISTANCE: 100 Ohms; TOLERANCE: ±1%
R6-R12 R48-R50 = Ampparts:ERJ-2GEJ102X; DESCRIPTION: 1 kOhms ±5% 0.1W, 1/10W Chip Resistor 0402 (1005 Metric) Automotive AEC-Q200 Thick Film; DIGI-KEY_PART_NUMBER: P1.0KJCT-ND; MF: Panasonic Electronic; MP: ERJ-2GEJ102X; PACKAGE: 1005 Panasonic Electronic Components
R14 R25-R28 R30-R34 R41-R44 R46 R52 R54 = Ampparts:ERJ-3GEYJ103V: Resistor; Thick Film; Res 10 Kilohms; Pwr-Rtg 0.1 W; Tol 5%; SMT; 0603; Cut Tape; DESCRIPTION: 10 kOhms ±5% 0.1W, 1/10W Chip Resistor 0603 (1608 Metric) Automotive AEC-Q200 Thick Film; DIGI-KEY_PART_NUMBER: P10KGCT-ND; MF: Panasonic; MP: ERJ-3GEYJ103V; PACKAGE: 1608 Panasonic Electronic Components
R15-R20 R38 R39 = VoltagemeasurementComponents:HVA12FA100M: 100 MOhms ±1% 0.5W, 1/2W Through Hole Resistor Axial High Voltage Metal Film; MANUFACTURER: Stackpole Electronics Inc; POWER: 0.5W; RESISTANCE: 100 MOhms; TOLERANCE: ±1%
R21-R24 = VoltagemeasurementComponents:HVR2500003483FR500: RES 348K OHM 1/4W 1% AXIAL; MANUFACTURER: Vishay BC Components; POWER: 0.25W; RESISTANCE: 348 kOhms; TOLERANCE: ±1%
RDIS1 = CAP_Diode_Megger:RESISTOR20OHM: Metal Oxide Resistors 10watt 200Mohm 1% 200ppm; MFR: Vishay / Dale; MFRNO: ROX300100MFNF5; POWER: 10w; R: 200 MOhms; TOLERENCE: 1%
REEDRELAY1-REEDRELAY4 = CAP_Diode_Megger:REEDRELAYSPDT: reed relays 7.5KV SPDT INDUSTRY STANDARD PACKAGES • UP TO 10,000 VDC SWITCHING VOLTAGE • UP TO 14,000 VDC DIELECTRIC STRENGTH • UP TO 200 WATTS / 5 AMP CARRY CURRENT • MULTI-POLE, FORM A AND FORM B CONTACTS • CUSTOM DESIGNS WELCOME
RELAY1-RELAY4 = CAP_Diode_Megger:T9GS1L14-5: General Purpose Relay SPST-NO (1 Form A) 5VDC Coil Through Hole; COILVOLTAGE: 5V; MANUFACTURER: TE Connectivity Potter & Brumfield Relays; SERIES: T9G; SWITCHINGVOLTAGE: 480VAC - Max; TYPE: SPST-NO
RS1 = CAP_Diode_Megger:CURRENTSENSERESISTOR: Current sense Resistor PCB track design around current sense resistors is generally more critical to performance than for normal resistors. The main difference is that four rather than two tracks must be provided to form a Kelvin connection, even where the component itself has only two terminals. The aim is to minimize the conductive path shared between the current path and the sensing loop, which would increase both the tolerance and the TCR of the mounted part. You can do this by connecting the voltage sense tracks to the inner edges of the solder pads (figure 3.) You can also take this a step further and split the voltage sense pads from the current path pads, so that the solder joints are also removed from the shared path By this method it is possible to approach the accuracy obtained from a true four terminal resistor. Modelled by Athar Zafeer
S1-S8 = switch-omron:31-XX: OMRON SWITCH; MPN: B3F-3100; OC_FARNELL: 959704; OC_NEWARK: 36M3582
SMD3 SMD4 SMD7 SMD8 SMD11 SMD12 SMD15 SMD16 SMD19 SMD20 SMD23 SMD24 SMD27 SMD28 SMD31 SMD32 SMD35 SMD36 SMD39 SMD40 = CAP_Diode_Megger:DIODE: Diode Standard 1300V 1A Surface Mount DO-214AC (SMA); MANUFACTURER: Micro Commercial Co; PACKAGE: DO-214AC, SMA; PARTNAME: GS1R-LTP; SPICEPREFIX: D; VF: 1V @ 1A
T1 T2 T5 T6 T8 T10 T12-T17 U$33 U$44 = Ampparts:SI2302A
T3 T7 T9 T11 = Ampparts:NX2301P,215: P-Channel 20V 2A (Ta) 400mW (Ta), 2.8W (Tc) Surface Mount TO-236AB; MANUFATURER: Nexperia USA Inc.; PACKAGE: TO-236-3, SC-59, SOT-23-3; PARTNO: NX2301P,215; VDSS: 20V; VGS: 120mOhm @ 1A, 4.5V
U1 = maincomputer parts:ATMEGA328P-AU: ATmega Series 20 MHz 32 KB Flash 2 KB SRAM 8-Bit Microcontroller - TQFP-32; DESCRIPTION: AVR AVR® ATmega Microcontroller IC 8-Bit 20MHz 32KB (16K x 16) FLASH 32-TQFP (7x7); DIGI-KEY_PART_NUMBER: ATMEGA328P-AURTR-ND; MF: Microchip Technology; MP: ATMEGA328P-AU; PACKAGE: TQFP-32 Microchip Technology
U2 = powersupply:TPS61088RHLR; ALTERNATEPARTNUMBER: TPS61088RHLT; APPLICATION_BUILDNUMBER: *; COMPTYPE: IC; MANUFACTURER: Texas Instruments; MANUFACTURER_NAME: Texas Instruments; MANUFACTURER_PART_NUMBER: TPS61088RHLR; MOUNTTYPE: SMT; PACKAGEREFERENCE: RHL0020A; PARTNUMBER: TPS61088RHLR; PIN_COUNT: 21; REFDES: RefDes; ROHS: Y; TYPE: TYPE
U3 = MAX13253:MAX13253ATB+T; BUILT_BY: EMA_UL_Team; MANUFACTURER_PART_NUMBER: MAX13253ATB+T; SOURCELIBRARY: Maxim_2015-01-06; SPICEPREFIX: X; VENDOR: Maxim Integrated Products
U$8 = powersupply:CRCW040234K0FKED; MANUFACTURER_NAME: VishayDale; MANUFACTURER_PART_NUMBER: CRCW040234K0FKED; POWER: 0.063; RESISTANCE: 34000.0; TOLERANCE: 1.0; VENDOR: VishayDale
U$9 = powersupply:CRCW0402102KFKED; MANUFACTURER_NAME: VishayDale; MANUFACTURER_PART_NUMBER: CRCW0402102KFKED; POWER: 0.063; RESISTANCE: 102000.0; TOLERANCE: 1.0; VENDOR: VishayDale
U$11 = powersupply:XAL5020-801MEB; DATASHEETURL: httpwww.coilcraft.compdfsxal5020.pdf; DCR: 0.0103; DESCRIPTION: Unknown; IDC: 12.0; L: 8.0E7; MANUFACTURER: CoilCraft; MANUFACTURER_NAME: Coilcraft; MANUFACTURER_PART_NUMBER: XAL5020801MEB; PACKAGE_DESIGNATOR: XAL5020; VENDOR: Coilcraft
U$13 = powersupply:CRCW0402267KFKED; MANUFACTURER_NAME: VishayDale; MANUFACTURER_PART_NUMBER: CRCW0402267KFKED; POWER: 0.063; RESISTANCE: 267000.0; TOLERANCE: 1.0; VENDOR: VishayDale
U$14 = powersupply:RC0603FR-07220KL; MANUFACTURER_NAME: Yageo; MANUFACTURER_PART_NUMBER: RC0603FR07220KL; POWER: 0.1; RESISTANCE: 220000.0; TOLERANCE: 1.0; VENDOR: Yageo America
U$15 = powersupply:CRCW040269K8FKED; MANUFACTURER_NAME: VishayDale; MANUFACTURER_PART_NUMBER: CRCW040269K8FKED; POWER: 0.063; RESISTANCE: 69800.0; TOLERANCE: 1.0; VENDOR: VishayDale
U$18 = BatteryCharger:RT9466: Charger IC Lithium Ion/Polymer 24-WQFN (4x4) datasheet; MANUFACTURER: Richtek USA Inc.; PARTNAME: RT9466GQW
U$19 = maincomputer parts:RPI-ZERO
U$20-U$23 = maincomputer parts:MC74HC238A: MC74HC238A 1-of-8 Decoder/ Demultiplexer High−Performance Silicon−Gate CMOS The MC74HC238A is identical in pinout to the LS238. The device inputs are compatible with standard CMOS outputs; with pullup resistors, they are compatible with LSTTL outputs. The HC238A decodes a three−bit Address to one−of−eight active−high outputs. This device features three Chip Select inputs, two active−low and one active−high to facilitate the demultiplexing, cascading, and chip−selecting functions. The demultiplexing function is accomplished by using the Address inputs to select the desired device output; one of the Chip Selects is used as a data input while the other Chip Selects are held in their active states.
U$25 U$29 = Ampparts:OPA300-ND: The OPA300 and OPA301 series high-speed, voltage-feedback, CMOS operational amplifiers are designed for 16-bit resolution systems. The OPA300/OPA301 series are unity-gain stable and feature excellent settling and harmonic distortion specifications. Low power applications benefit from low quiescent current. The OPA300 and OPA2300 feature a digital shutdown (Enable) function to provide additional power savings during idle periods. Optimized for single-supply operation, the OPA300/OPA301 series offer superior output swing and excellent common-mode range. The OPA300 and OPA301 series op amps have 150MHz of unity-gain bandwidth, low 3nV/√Hz voltage noise, and 0.1% settling within 30ns. Single-supply operation from 2.7V (±1.35V) to 5.5V (±2.75V) and an available shutdown function that reduces supply current to 5µA are useful for portable low-power applications. The OPA300 and OPA301 are available in SO-8 and SOT-23 packages. The OPA2300 is available in MSOP-10, and the OPA2301 is available in SO-8 and MSOP-8. All versions are specified over the industrial temperature range of −40°C to +125°C.
U$39 = CAP_Diode_Megger:REEDRELAYSPDT: reed relays 7.5KV SPDT INDUSTRY STANDARD PACKAGES • UP TO 10,000 VDC SWITCHING VOLTAGE • UP TO 14,000 VDC DIELECTRIC STRENGTH • UP TO 200 WATTS / 5 AMP CARRY CURRENT • MULTI-POLE, FORM A AND FORM B CONTACTS • CUSTOM DESIGNS WELCOME; SPICEPREFIX: S
X1 X2 = ngspice-simulation:TRANSFORMER: Coupled inductors The RATIO is defined in the schematic by using the text command and adding a line that says: .PARAM RATIO=x Where x is the turns ratio of the transformer